# Altium schematic sheet MainSch.SchDoc: Main Schematic
size A; DrawnBy: Enrique Morell; Engineer: Enrique Morell; DocumentNumber: 1; Revision: v0.1; SheetNumber: 1; SheetTotal: 9
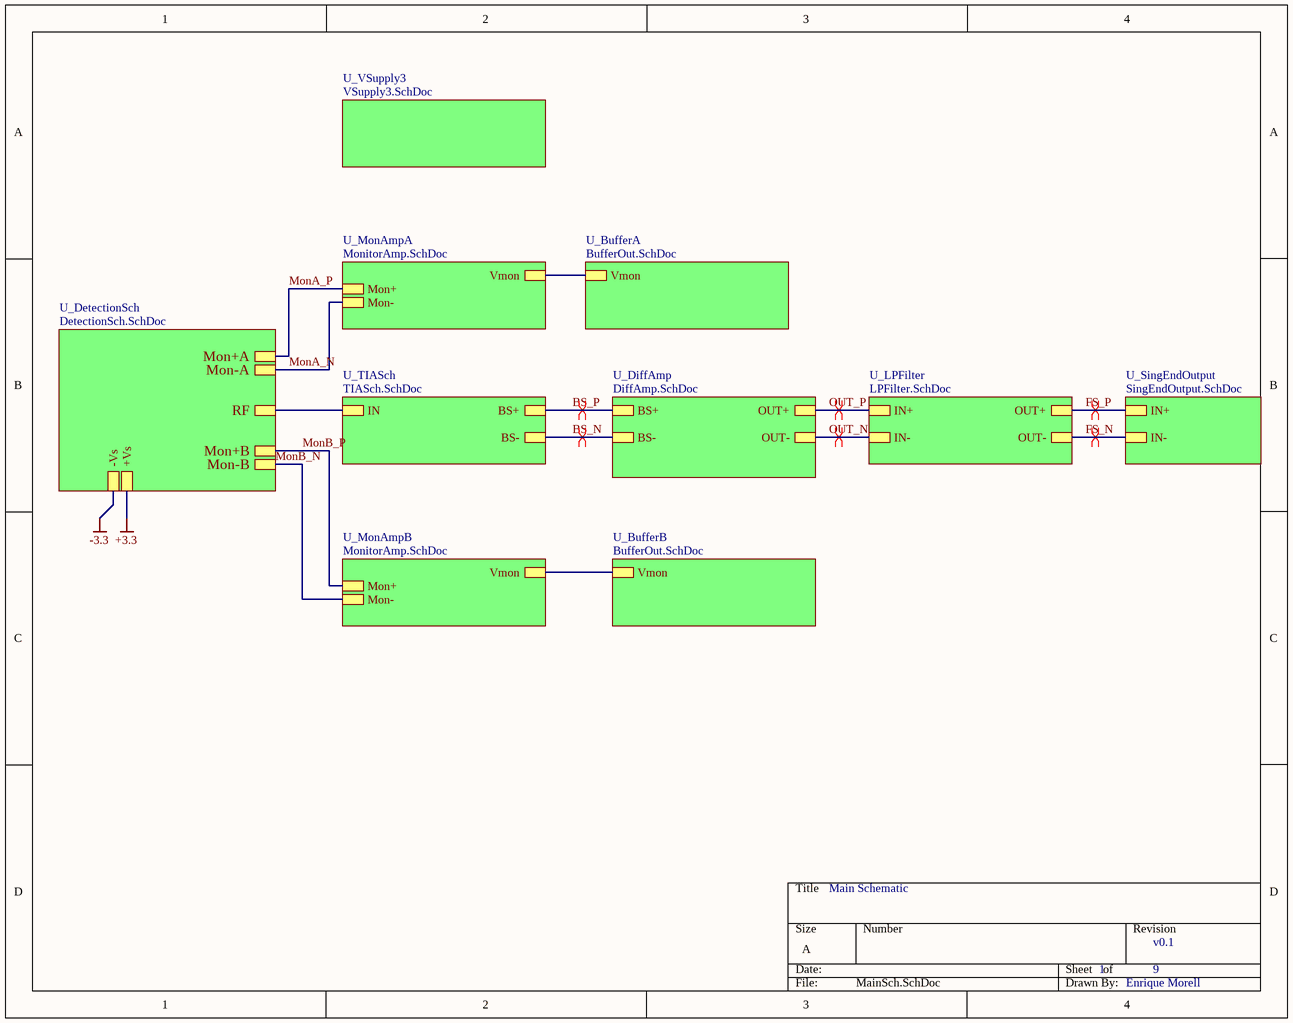
[diagram p0: MainSch.SchDoc]

## Sub-sheets
U_BufferA = BufferOut.SchDoc: Vmon
U_BufferB = BufferOut.SchDoc: Vmon
U_DetectionSch = DetectionSch.SchDoc: Mon+A, Mon-A, RF, Mon+B, Mon-B, -Vs, +Vs
U_DiffAmp = DiffAmp.SchDoc: BS-, BS+, OUT-, OUT+
U_LPFilter = LPFilter.SchDoc: IN+, IN-, OUT+, OUT-
U_MonAmpA = MonitorAmp.SchDoc: Vmon, Mon-, Mon+
U_MonAmpB = MonitorAmp.SchDoc: Vmon, Mon-, Mon+
U_SingEndOutput = SingEndOutput.SchDoc: IN+, IN-
U_TIASch = TIASch.SchDoc: IN, BS-, BS+
U_VSupply3 = VSupply3.SchDoc: no entries

## Nets
+3.3: sheet U_DetectionSch/+Vs
-3.3: sheet U_DetectionSch/-Vs
BS_N: sheet U_TIASch/BS-, sheet U_DiffAmp/BS-
BS_P: sheet U_TIASch/BS+, sheet U_DiffAmp/BS+
FS_N: sheet U_LPFilter/OUT-, sheet U_SingEndOutput/IN-
FS_P: sheet U_LPFilter/OUT+, sheet U_SingEndOutput/IN+
MonA_N: sheet U_DetectionSch/Mon-A, sheet U_MonAmpA/Mon-
MonA_P: sheet U_DetectionSch/Mon+A, sheet U_MonAmpA/Mon+
MonB_N: sheet U_DetectionSch/Mon-B, sheet U_MonAmpB/Mon-
MonB_P: sheet U_DetectionSch/Mon+B, sheet U_MonAmpB/Mon+
OUT_N: sheet U_DiffAmp/OUT-, sheet U_LPFilter/IN-
OUT_P: sheet U_DiffAmp/OUT+, sheet U_LPFilter/IN+
(unnamed): sheet U_DetectionSch/RF, sheet U_TIASch/IN
(unnamed): sheet U_MonAmpA/Vmon, sheet U_BufferA/Vmon
(unnamed): sheet U_MonAmpB/Vmon, sheet U_BufferB/Vmon

## Layout directives
differential pair: BS_N, BS_P, FS_N, FS_P, OUT_N, OUT_P